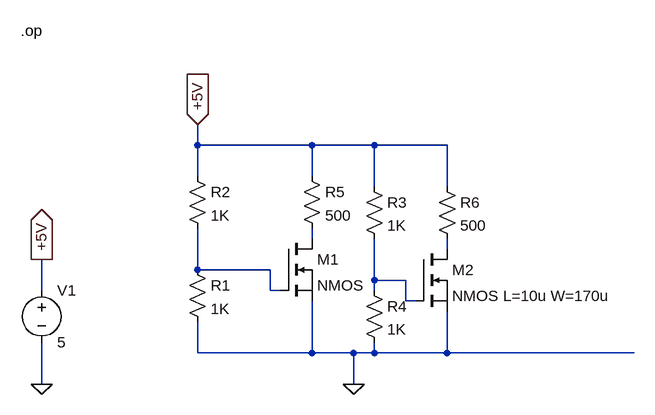
[diagram p0: schematic CMOS_CHANGE_WIDTH_AND_LENGTH.asc]
CMOS_CHANGE_WIDTH_AND_LENGTH.asc, the LTspice schematic file:
Version 4
SHEET 1 1064 680
WIRE 32 -32 32 -64
WIRE 208 -32 32 -32
WIRE 304 -32 208 -32
WIRE 416 -32 304 -32
WIRE 32 16 32 -32
WIRE 208 16 208 -32
WIRE 304 32 304 -32
WIRE 416 32 416 -32
WIRE 208 112 208 96
WIRE 416 128 416 112
WIRE 32 160 32 96
WIRE 144 160 32 160
WIRE 304 176 304 112
WIRE 352 176 304 176
WIRE -208 192 -208 144
WIRE 144 192 144 160
WIRE 160 192 144 192
WIRE 304 192 304 176
WIRE 352 208 352 176
WIRE 368 208 352 208
WIRE 32 288 32 240
WIRE 208 288 208 208
WIRE 208 288 32 288
WIRE 272 288 208 288
WIRE 304 288 304 272
WIRE 304 288 272 288
WIRE 416 288 416 224
WIRE 416 288 304 288
WIRE 704 288 416 288
WIRE -208 336 -208 272
WIRE 272 336 272 288
FLAG 272 336 0
FLAG -208 336 0
FLAG -208 144 +5V
IOPIN -208 144 Out
FLAG 32 -64 +5V
IOPIN 32 -64 In
SYMBOL res 16 144 R0
SYMATTR InstName R1
SYMATTR Value 1K
SYMBOL res 16 0 R0
SYMATTR InstName R2
SYMATTR Value 1K
SYMBOL res 288 16 R0
SYMATTR InstName R3
SYMATTR Value 1K
SYMBOL res 288 176 R0
SYMATTR InstName R4
SYMATTR Value 1K
SYMBOL res 192 0 R0
SYMATTR InstName R5
SYMATTR Value 500
SYMBOL res 400 16 R0
SYMATTR InstName R6
SYMATTR Value 500
SYMBOL voltage -208 176 R0
WINDOW 123 0 0 Left 0
WINDOW 39 0 0 Left 0
SYMATTR InstName V1
SYMATTR Value 5
SYMBOL nmos 160 112 R0
SYMATTR InstName M1
SYMBOL nmos 368 128 R0
SYMATTR InstName M2
SYMATTR Value NMOS L=10u W=170u
TEXT -240 -208 Left 2 !.op

The netlist it stands for:
* CMOS_CHANGE_WIDTH_AND_LENGTH.asc
R1 N003 0 1K
R2 +5V N003 1K
R3 +5V N004 1K
R4 N004 0 1K
R5 +5V N001 500
R6 +5V N002 500
V1 +5V 0 5
M1 N001 N003 0 0 NMOS
M2 N002 N004 0 0 NMOS L=10u W=170u
.model NMOS NMOS
.model PMOS PMOS
.lib standard.mos
.op
.backanno
.end